# Altium schematic sheet SWD.SchDoc: SWD
size 279 x 215 mm; Engineer: Prasoon Sinha; DocumentNumber: 7; SheetNumber: 7; SheetTotal: 26
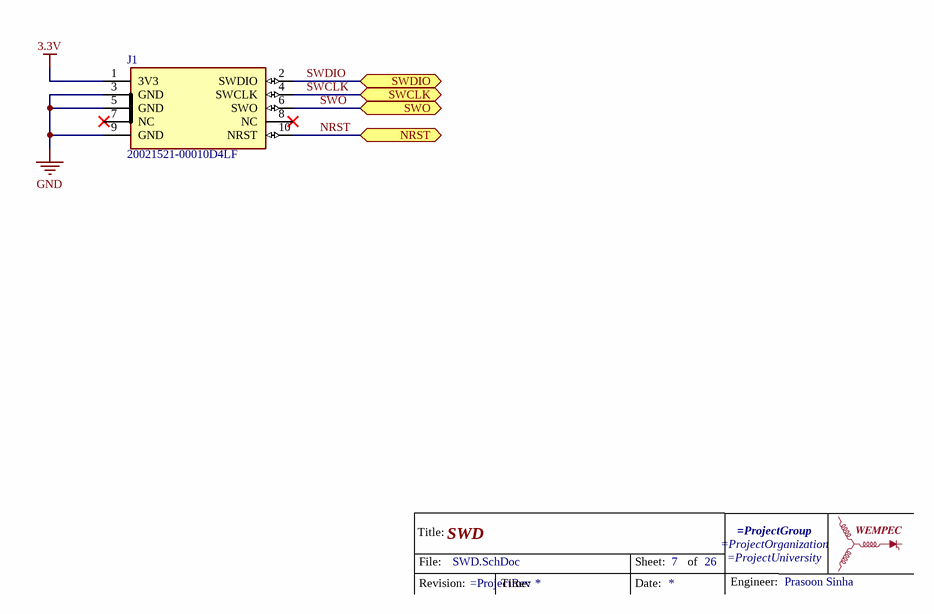
[diagram p0: SWD.SchDoc]

## Parts
*?  TitleBlockWEMPEC  (value not drawn)  (graphical)
J1  20021521-00010D4LF  [20021521-00010D4LF]

## Ports
NRST (bidir), SWCLK (bidir), SWDIO (bidir), SWO (bidir)

## Nets
3.3V: J1.1(3V3)
GND: J1.3(GND) J1.5(GND) J1.9(GND)
NRST: J1.10(NRST) ; port NRST
SWCLK: J1.4(SWCLK) ; port SWCLK
SWDIO: J1.2(SWDIO) ; port SWDIO
SWO: J1.6(SWO) ; port SWO

Not connected (* = marked no-connect by the designer): J1 7(NC)* 8(NC)*

## Notes on the sheet
- (in symbol TitleBlockWEMPEC) Title:; File:; Sheet:; of; Engineer:; Revision:; Time:; Date:

## Library data of the parts
J1 = 20021521-00010D4LF: SWD Connector Header Surface Mount 10 position 0.050" (1.27mm); Supplier Part Number 1: 609-6533-ND